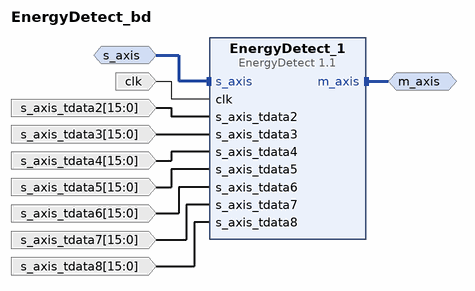
[diagram p0: block diagram of the top level]
# Vivado block design EnergyDetect_bd, xczu28dr-ffvg1517-2-e, Vivado 2024.1
create_bd_design EnergyDetect_bd

create_bd_intf_port -mode Master -vlnv xilinx.com:interface:axis_rtl:1.0 m_axis
create_bd_intf_port -mode Slave -vlnv xilinx.com:interface:axis_rtl:1.0 s_axis
set_property -dict [list \
  CONFIG.HAS_TKEEP 0 \
  CONFIG.HAS_TLAST 1 \
  CONFIG.HAS_TREADY 1 \
  CONFIG.HAS_TSTRB 0 \
  CONFIG.LAYERED_METADATA {['xilinx.com:interface:datatypes:1.0 {', 'TDATA {datatype {name {attribs {resolve_type immediate dependency {} format string minimum {} maximum {}} value {}} bitwidth {attribs {resolve_type immediate dependency {} format long minimum {}', 'maximum {}} value 16} bitoffset {attribs {resolve_type immediate dependency {} format long minimum {} maximum {}} value 0} real {fixed {fractwidth {attribs {resolve_type immediate dependency {} format', 'long minimum {} maximum {}} value 14} signed {attribs {resolve_type immediate dependency {} format bool minimum {} maximum {}} value true}}}}}', '}']} \
  CONFIG.TDATA_NUM_BYTES 2 \
  CONFIG.TDEST_WIDTH 0 \
  CONFIG.TID_WIDTH 0 \
  CONFIG.TUSER_WIDTH 0 \
] [get_bd_intf_ports s_axis]
create_bd_port -dir I -type clk clk
create_bd_port -dir I -from 15 -to 0 -type data s_axis_tdata2
create_bd_port -dir I -from 15 -to 0 -type data s_axis_tdata3
create_bd_port -dir I -from 15 -to 0 -type data s_axis_tdata4
create_bd_port -dir I -from 15 -to 0 -type data s_axis_tdata5
create_bd_port -dir I -from 15 -to 0 -type data s_axis_tdata6
create_bd_port -dir I -from 15 -to 0 -type data s_axis_tdata7
create_bd_port -dir I -from 15 -to 0 -type data s_axis_tdata8

create_bd_cell -type ip -vlnv CoRSoC:VMC:EnergyDetect:1.1 EnergyDetect_1

# ---- connections ----

connect_bd_intf_net [get_bd_intf_pins EnergyDetect_1/m_axis] [get_bd_intf_ports m_axis]
connect_bd_intf_net [get_bd_intf_pins EnergyDetect_1/s_axis] [get_bd_intf_ports s_axis]
connect_bd_net [get_bd_ports clk] [get_bd_pins EnergyDetect_1/clk]
connect_bd_net -net s_axis_tdata2_1 [get_bd_ports s_axis_tdata2] [get_bd_pins EnergyDetect_1/s_axis_tdata2]
connect_bd_net -net s_axis_tdata3_1 [get_bd_ports s_axis_tdata3] [get_bd_pins EnergyDetect_1/s_axis_tdata3]
connect_bd_net -net s_axis_tdata4_1 [get_bd_ports s_axis_tdata4] [get_bd_pins EnergyDetect_1/s_axis_tdata4]
connect_bd_net -net s_axis_tdata5_1 [get_bd_ports s_axis_tdata5] [get_bd_pins EnergyDetect_1/s_axis_tdata5]
connect_bd_net -net s_axis_tdata6_1 [get_bd_ports s_axis_tdata6] [get_bd_pins EnergyDetect_1/s_axis_tdata6]
connect_bd_net -net s_axis_tdata7_1 [get_bd_ports s_axis_tdata7] [get_bd_pins EnergyDetect_1/s_axis_tdata7]
connect_bd_net -net s_axis_tdata8_1 [get_bd_ports s_axis_tdata8] [get_bd_pins EnergyDetect_1/s_axis_tdata8]

validate_bd_design
save_bd_design
